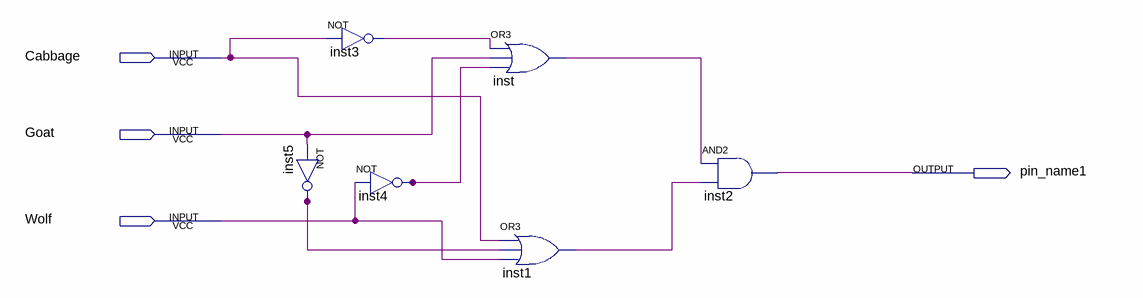
[diagram p0: schematic sheet]
// Quartus schematic lab2step2.bdf as structural Verilog: 6 symbols, 4 pins
module lab2step2 (
  input  Cabbage,
  input  Goat,
  input  Wolf,
  output pin_name1
);

  wire inst1_out, inst3_out, inst4_out, inst5_out, inst_out;

  not inst5 (inst5_out, Goat);
  not inst3 (inst3_out, Cabbage);
  not inst4 (inst4_out, Wolf);
  or inst (inst_out, inst3_out, Goat, inst4_out);
  or inst1 (inst1_out, Cabbage, inst5_out, Wolf);
  and inst2 (pin_name1, inst_out, inst1_out);
endmodule
